# Altium schematic sheet 1_SurvBot_RCU_Power.SchDoc
size A3; SheetNumber: 2; SheetTotal: 8
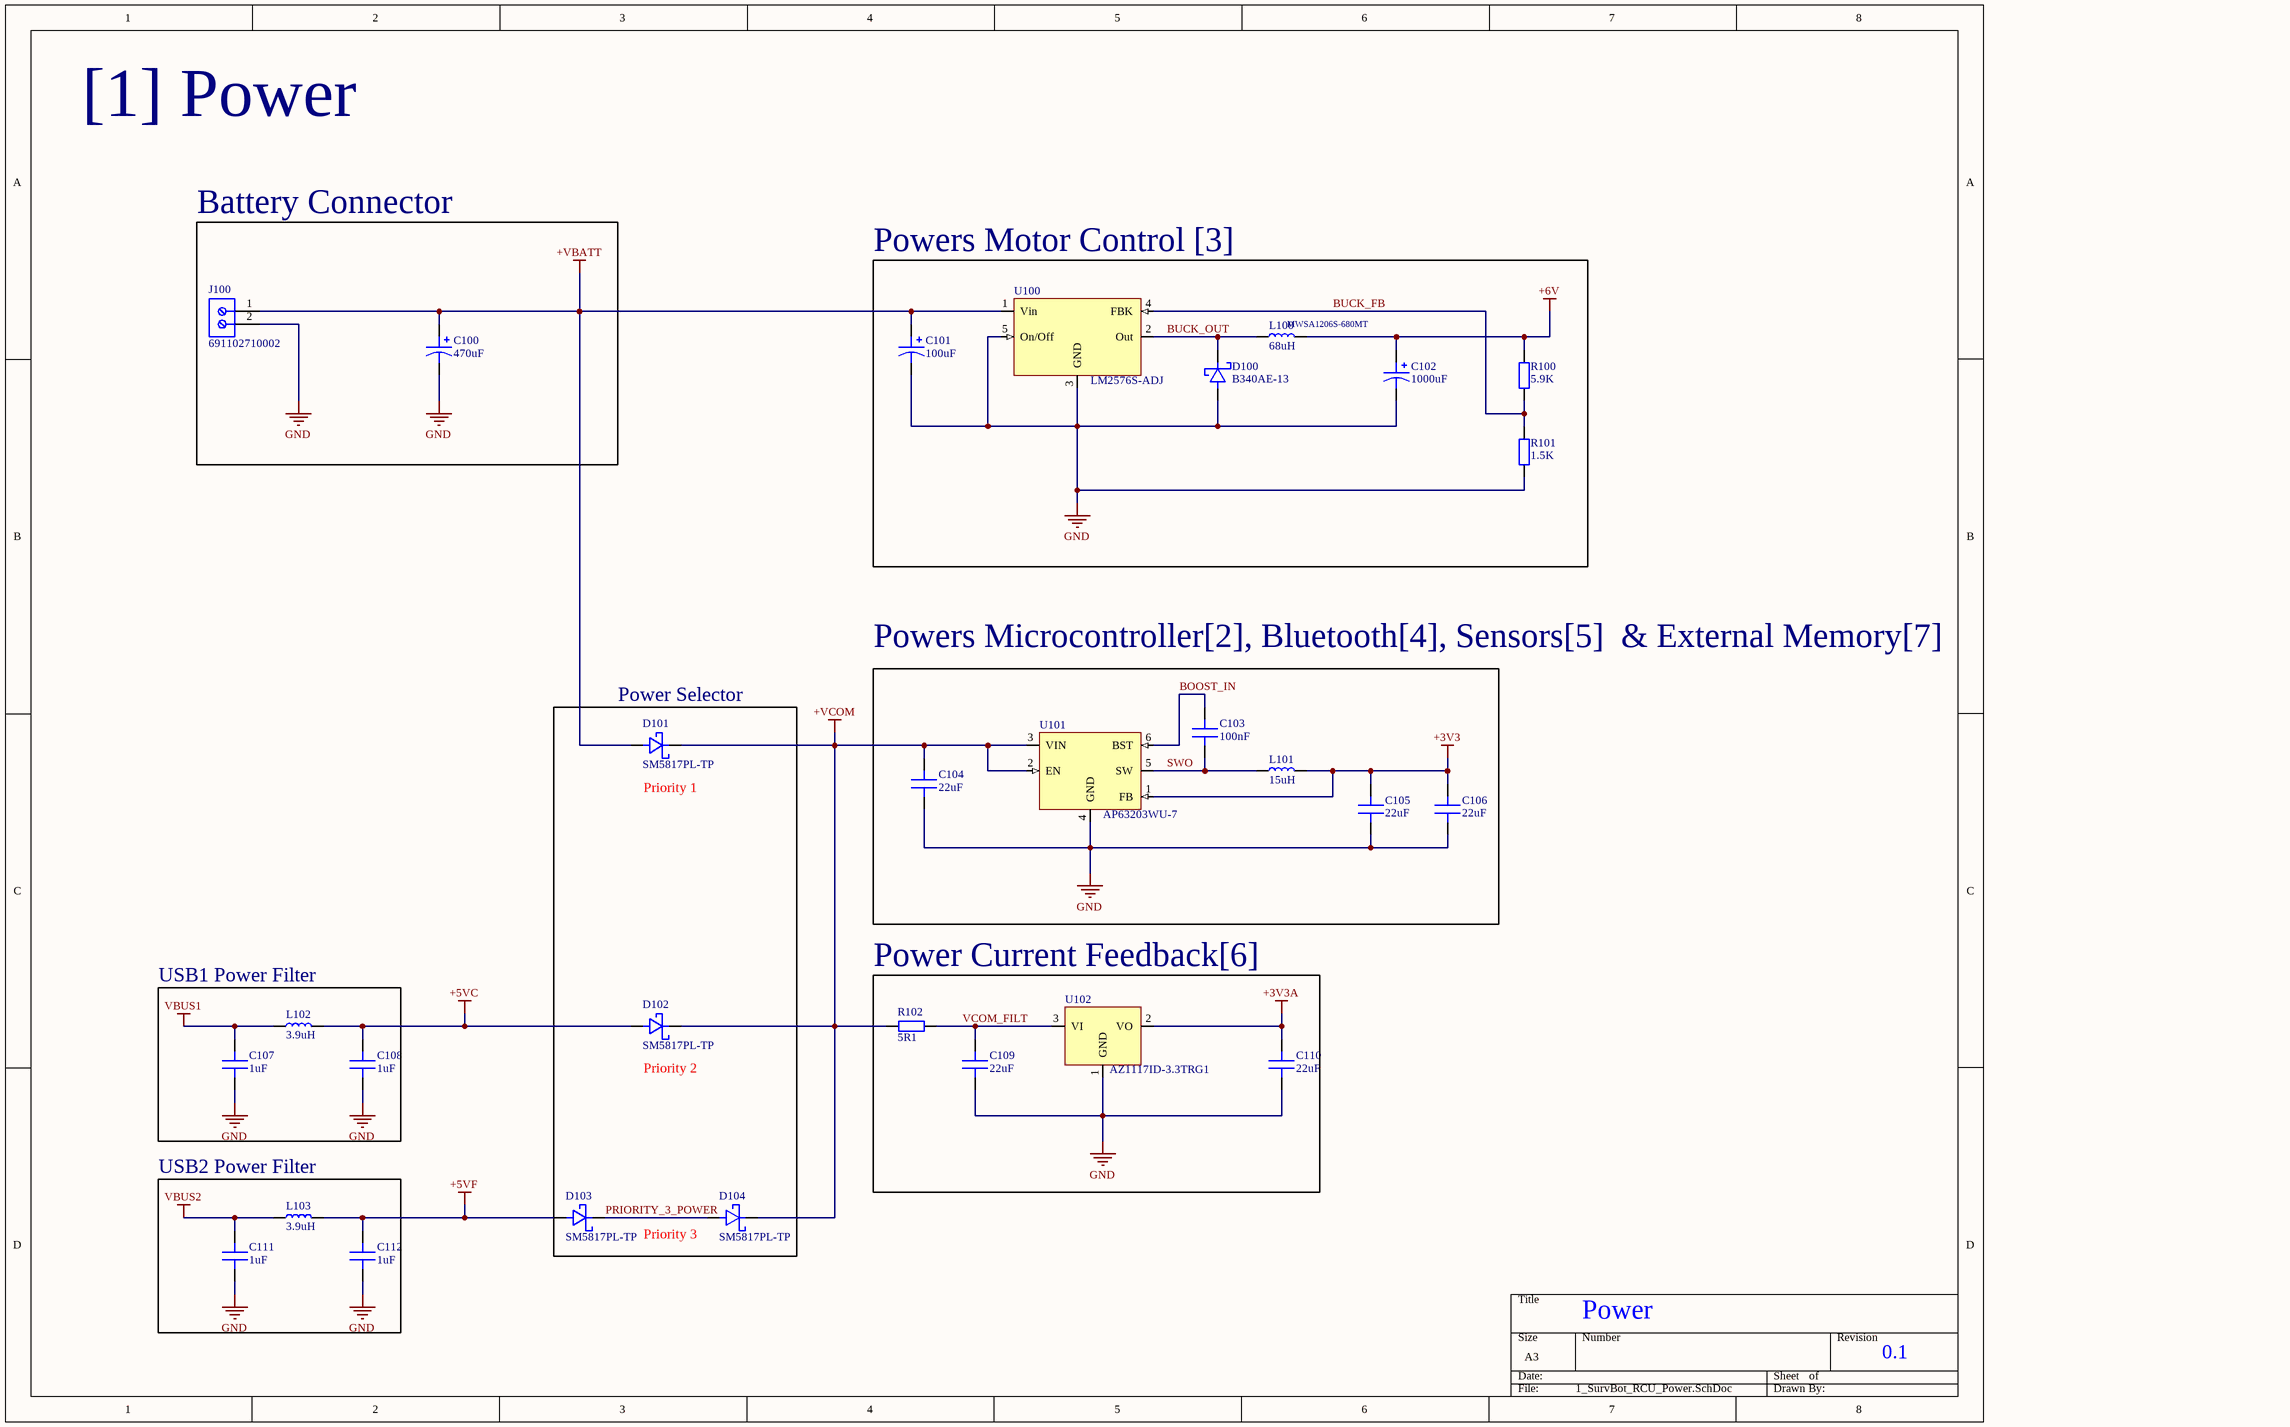
[diagram p0: 1_SurvBot_RCU_Power.SchDoc]

## Parts
C100  470uF  [CAP-THT_RADIAL_D10.00mm_P5.00mm]
C101  100uF  [CAP-THT-Radial__D8.0mmP3.5mm]
C102  1000uF  [CAP-THT_RADIAL_D10.00mm_P5.00mm]
C103  100nF  [CAP_0603]
C104  22uF  [CAP_0603]
C105  22uF  [CAP_0603]
C106  22uF  [CAP_0603]
C107  1uF  [CAP_0603]
C108  1uF  [CAP_0603]
C109  22uF  [CAP_0603]
C110  22uF  [CAP_0603]
C111  1uF  [CAP_0603]
C112  1uF  [CAP_0603]
D100  B340AE-13  [DO-214AC, SMA]
D101  SM5817PL-TP  [DIO-SOD-123FL]
D102  SM5817PL-TP  [DIO-SOD-123FL]
D103  SM5817PL-TP  [DIO-SOD-123FL]
D104  SM5817PL-TP  [DIO-SOD-123FL]
J100  691102710002  [691102710002]
L100  68uH  [IND-SMD_13.45x12.45mm]
L101  15uH  [IND-SMD_ 4.90x4.90mm]
L102  3.9uH  [IND_SMD-3.00MMX3.00MM]
L103  3.9uH  [IND_SMD-3.00MMX3.00MM]
R100  5.9K  [RES_0603]
R101  1.5K  [RES_0603]
R102  5R1  [RES_1206]
U100  LM2576S-ADJ  [TO-263-6, D2PAK (5 Leads + Tab), TO-263BA]
U101  AP63203WU-7  [SOT-23-6 Thin, TSOT-23-6]
U102  AZ1117ID-3.3TRG1  [TO-252-3, DPAK (2 Leads + Tab), SC-63]

## Blocks framed on the sheet
Battery Connector: C100 J100
Powers Motor Control [3]: C101 C102 D100 L100 R100 R101 U100
Power Selector: D101-D104
Power Current Feedback[6]: C109 C110 R102 U102
USB1 Power Filter: C107 C108 L102
USB2 Power Filter: C111 C112 L103

## Nets
+3V3: C105.2 C106.2 L101.2 U101.1(FB)
+3V3A: C110.2 U102.2(VO)
+5VC: C108.2 D102.A L102.2
+5VF: C112.2 D103.A L103.2
+6V: C102.1 L100.2 R100.2
+VBATT: C100.1 C101.1 D101.A J100.1 U100.1(Vin)
+VCOM: C104.2 D101.K D102.K D104.K R102.1 U101.2(EN) U101.3(VIN)
GND: C100.2 C101.2 C102.2 C104.1 C105.1 C106.1 C107.1 C108.1 C109.1 C110.1 C111.1 C112.1 D100.A J100.2 R101.1 U100.3(GND) U100.5(On/Off) U101.4(GND) U102.1(GND)
VBUS1: C107.2 L102.1
VBUS2: C111.2 L103.1
BOOST_IN: C103.2 U101.6(BST)
BUCK_FB: R100.1 R101.2 U100.4(FBK)
BUCK_OUT: D100.K L100.1 U100.2(Out)
PRIORITY_3_POWER: D103.K D104.A
SWO: C103.1 L101.1 U101.5(SW)
VCOM_FILT: C109.2 R102.2 U102.3(VI)

## Notes on the sheet
- [1] Power
- (near L100) MWSA1206S-680MT
- Powers Microcontroller[2], Bluetooth[4], Sensors[5]  & External Memory[7]
- (near D101) Priority 1
- (near D102) Priority 2
- (near D104) Priority 3
- Power
- 0.1

## Library data of the parts
C100 = CAP_470uF-35V-20%-RADIAL-TH: 470 µF 35 V Aluminum Electrolytic Capacitors Radial, Can 10000 Hrs @ 105°C; Manufacturer: Rubycon; Manufacturer Part #: 35ZLH470MEFC10X16; Case/Package: TH,D10xL16mm; Supplier: JLCPCB; Supplier Part #: C338196
C101 = CAP_100uF-50V-20%-RADIAL-TH: 100 µF 50 V Aluminum Electrolytic Capacitors Radial, Can 8000 Hrs @ 105°C; Manufacturer: Rubycon; Manufacturer Part #: 50ZLH100MEFC8X11.5; Case/Package: TH,D8xL11.5mm; Supplier: JLCPCB; Supplier Part #: C109393
C102 = CAP_1000uF-16V-20%-RADIAL-TH: 1000 µF 16 V Aluminum Electrolytic Capacitors Radial, Can 10000 Hrs @ 105°C; Manufacturer: Rubycon; Manufacturer Part #: 16ZLH1000MEFC10X16; Case/Package: TH,D10xL16mm; Supplier: JLCPCB; Supplier Part #: C338175
C103 = CAP_100nF-50V-10%-0603: 0.1 µF ±10% 50V Ceramic Capacitor X7R 0603 (1608 Metric); Manufacturer: KEMET; Manufacturer Part #: C0603C104K5RACAUTO; Case/Package: 0603; Supplier: JLCPCB; Supplier Part #: C129621
C104-C106 C109 C110 = CAP_22uF-10V-20%-0603: 22 µF ±20% 10V Ceramic Capacitor X5R 0603 (1608 Metric); Manufacturer: Samsung Electro-Mechanics; Manufacturer Part #: CL10A226MP8NUNE; Case/Package: 0603; Supplier: JLCPCB; Supplier Part #: C86295
C107 C108 C111 C112 = CAP_1uF-16V-10%-0603: 1 µF ±10% 16V Ceramic Capacitor X7R 0603 (1608 Metric); Manufacturer: YAGEO; Manufacturer Part #: CC0603KRX7R7BB105; Case/Package: 0603; Supplier: JLCPCB; Supplier Part #: C106248
D100 = DIO-S_0.5V-40V-3A-SMA: Diode 40 V 3A Surface Mount SMA; Manufacturer: DIODES INCORPORATED; Manufacturer Part #: B340AE-13; Case/Package: SMA; Supplier: JLCPCB; Supplier Part #: C168859
D101-D104 = DIO-S_0.45V-20V-1A-SOD-123FL: Diode 20 V 1A Surface Mount SOD-123FL; Manufacturer: MCC(Micro Commercial Components); Manufacturer Part #: SM5817PL-TP; Case/Package: SOD-123FL; Supplier: JLCPCB; Supplier Part #: C669022
J100 = CMP-1502-03258-2: NexarPartId: 8917706; Number of Levels: 1; Number of Positions Per Level: 2; Current: 15A; Voltage: 300V; Pitch: 5.0038mm; Plating: Steel; Stripping Length: -6mm; Wire Gauge (Min): 14AWG; Wire Gauge (Max): 22AWG; Length: 7.5mm; Contact Material: Brass; Contact Plating: Tin; Packaging: Box; Number of Pins: 2; Voltage Rating: 300V; Termination: Screw; Number of Contacts: 2; Color: Blue; Current Rating: 15A; Mount: Through Hole; Max Operating Temperature: 105°C; Min Operating Temperature: -40°C; REACH SVHC: Unknown; Height: 13.4mm; Width: 11.2mm; Housing Material: Nylon; RoHS: Compliant; Wire/Cable Gauge: 22AWG; Lead Pitch: 5mm
L100 = IND_68uH-4A-20%-SMD: 68 µH Shielded Drum Core, Wirewound Inductor 4 A 140mOhm Max Nonstandard; Manufacturer: Sunlord; Manufacturer Part #: MWSA1206S-680MT; Case/Package: SMD,13.5x12.6mm; Supplier: JLCPCB; Supplier Part #: C408532
L101 = IND_15uH-1.2A-20%-SMD: 15 µH Shielded Drum Core, Wirewound Inductor 1.2 A 198mOhm Max Nonstandard; Manufacturer: Taiyo Yuden; Manufacturer Part #: NRS5020T150MMGJ; Case/Package: SMD,4.9x4.9mm; Supplier: JLCPCB; Supplier Part #: C222920
L102 L103 = IND_3.9uH-2.1A-20%-SMD: 3.9 µH Shielded Drum Core, Wirewound Inductor 1.5 A 115mOhm Max Nonstandard; Manufacturer: Sunlord; Manufacturer Part #: SPH3015H3R9MT; Case/Package: SMD,3x3mm; Supplier: JLCPCB; Supplier Part #: C431700
R100 = RES_5.9K-100mW-1%-0603: RES 5.9K OHM 1% 100mW SMD-0603 Thick film Resistor; Manufacturer: PANASONIC; Manufacturer Part #: ERJ3EKF5901V; Case/Package: 0603; Supplier: JLCPCB; Supplier Part #: C403290
R101 = RES_1.5K-250mW-1%-0603: RES 1.5K OHM 1% 250mW SMD-0603 Thick film Resistor; Manufacturer: PANASONIC; Manufacturer Part #: ERJPA3F1501V; Case/Package: 0603; Supplier: JLCPCB; Supplier Part Number: C543357
R102 = RES_5R1-600mW-5%-1206: 600mW Thick Film Resistors 200V ±5% ±400ppm/℃ 5.1Ω 1206 Chip Resistor - Surface Mount; Manufacturer: UNI-ROYAL(Uniroyal Elec); Manufacturer Part #: AS0606J051JT5E; Case/Package: 1206; Supplier: JLCPCB; Supplier Part #: C966043
U100 = LM2576S-ADJ: Buck Switching Regulator IC Positive Adjustable 1 Output 3A TO-263-6, D2PAK (5 Leads + Tab), TO-263BA; Manufacturer: UMW(Youtai Semiconductor Co., Ltd.); Manufacturer Part #: LM2576S-ADJ; Case/Package: TO-263-5; Supplier: JLCPCB; Supplier Part #: C347415
U101 = AP63203WU-7 TSOT-23-6: Buck Switching Regulator IC Positive Fixed 3.3V 1 Output 2A SOT-23-6 Thin, TSOT-23-6; Manufacturer: Diodes Incorporated; Manufacturer Part #: AP63203WU-7; Case/Package: TSOT-23-6; Supplier: JLCPCB; Supplier Part #: C780769
U102 = AZ1117ID-3.3TRG1: Linear Voltage Regulator IC Positive Fixed 1 Output 1A TO-252-3; Manufacturer: Diodes Incorporated; Manufacturer Part #: AZ1117ID-3.3TRG1; Case/Package: TO-252-2; Supplier: JLCPCB; Supplier Part #: C2926306